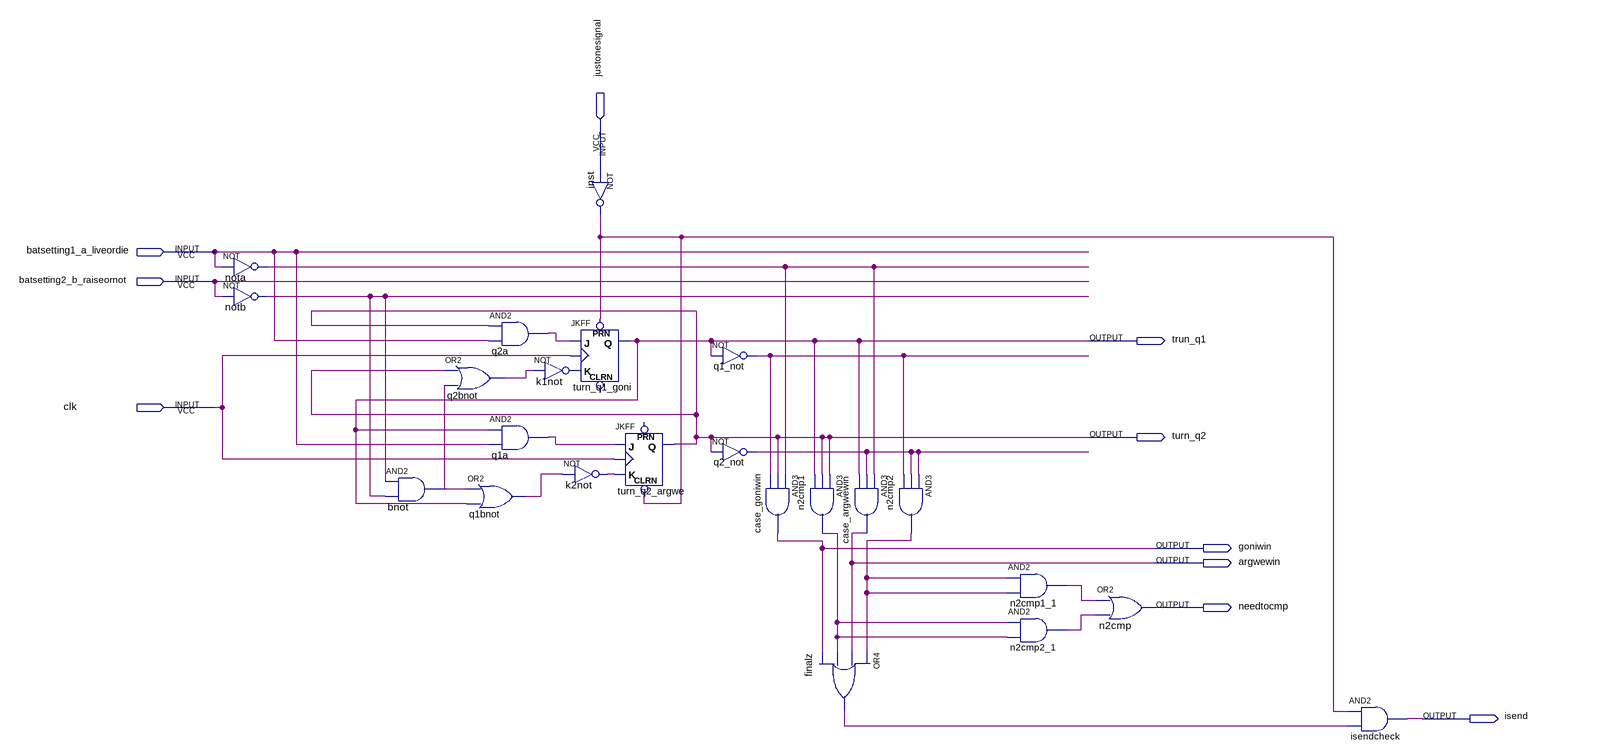
[diagram p0: schematic sheet]
// Quartus schematic battingmodule.bdf as structural Verilog: 23 symbols, 10 pins
module battingmodule (
  input  justonesignal,
  input  batsetting1_a_liveordie,
  input  batsetting2_b_raiseornot,
  input  clk,
  output trun_q1,
  output turn_q2,
  output goniwin,
  output argwewin,
  output needtocmp,
  output isend
);

  wire bnot_out, finalz_out, inst_out, k1not_out, k2not_out, n2cmp1_1_out, n2cmp1_out, n2cmp2_1_out,
       n2cmp2_out, nota_out, notb_out, q1_not_out, q1a_out, q1bnot_out, q2_not_out, q2a_out, q2bnot_out;

  not nota (nota_out, batsetting1_a_liveordie);
  not notb (notb_out, batsetting2_b_raiseornot);
  and bnot (bnot_out, notb_out, notb_out);
  or q2bnot (q2bnot_out, turn_q2, bnot_out);
  and q2a (q2a_out, turn_q2, batsetting1_a_liveordie);
  and q1a (q1a_out, trun_q1, batsetting1_a_liveordie);
  or q1bnot (q1bnot_out, bnot_out, trun_q1);
  JKFF turn_q1_goni (.PRN(inst_out), .K(k1not_out), .J(q2a_out), .CLK(clk), .Q(trun_q1));  // open: CLRN
  not k1not (k1not_out, q2bnot_out);
  not k2not (k2not_out, q1bnot_out);
  not inst (inst_out, justonesignal);
  JKFF turn_q2_argwe (.CLRN(inst_out), .K(k2not_out), .J(q1a_out), .CLK(clk), .Q(turn_q2));  // open: PRN
  not q1_not (q1_not_out, trun_q1);
  not q2_not (q2_not_out, turn_q2);
  and case_goniwin (goniwin, nota_out, turn_q2, q1_not_out);
  and n2cmp1 (n2cmp1_out, turn_q2, turn_q2, trun_q1);
  or finalz (finalz_out, n2cmp2_out, argwewin, n2cmp1_out, goniwin);
  and case_argwewin (argwewin, nota_out, q2_not_out, trun_q1);
  and n2cmp2 (n2cmp2_out, q2_not_out, q2_not_out, q1_not_out);
  and n2cmp1_1 (n2cmp1_1_out, n2cmp2_out, n2cmp2_out);
  and n2cmp2_1 (n2cmp2_1_out, n2cmp1_out, n2cmp1_out);
  or n2cmp (needtocmp, n2cmp1_1_out, n2cmp2_1_out);
  and isendcheck (isend, inst_out, finalz_out);
endmodule
